# EAGLE schematic Ex 4 LED FadeInOut (EAGLE 7.6.0)
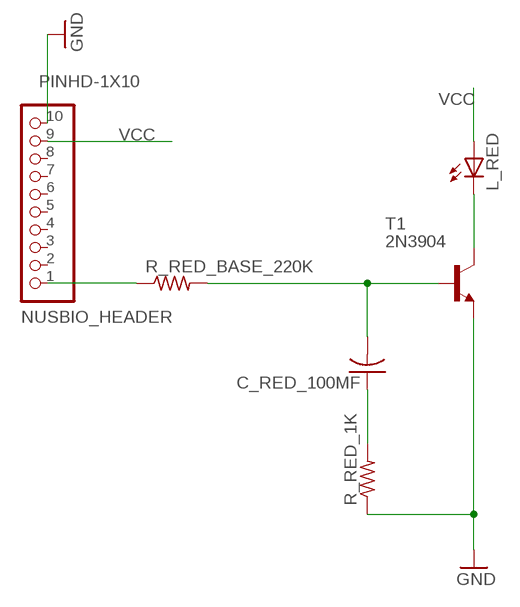
[diagram p0: schematic, sheet 1]

## Parts
C_RED_100MF  C-US025-030X050  [C025-030X050]
L_RED  LED5MM  [LED5MM]
NUSBIO_HEADER  PINHD-1X10  [1X10-BIG]
R_RED_1K  R-US_0207/10  [0207/10]
R_RED_BASE_220K  R-US_0207/10  [0207/10]
T1  2N3904  [TO92]

## Nets
GND: NUSBIO_HEADER.10 R_RED_1K.1 T1.3(E)
N$1: NUSBIO_HEADER.1 R_RED_BASE_220K.1
N$2: C_RED_100MF.2 R_RED_BASE_220K.2 T1.2(B)
N$3: L_RED.K(C) T1.1(C)
N$4: C_RED_100MF.1 R_RED_1K.2
VCC: L_RED.A NUSBIO_HEADER.9
Unconnected: NUSBIO_HEADER.2 NUSBIO_HEADER.3 NUSBIO_HEADER.4 NUSBIO_HEADER.5 NUSBIO_HEADER.6 NUSBIO_HEADER.7 NUSBIO_HEADER.8

## Library data of the parts
C_RED_100MF = adafruit:C-US: CAPACITOR, American symbol
L_RED = adafruit:LED: LED OSRAM: - CHIPLED LG R971, LG N971, LY N971, LG Q971, LY Q971, LO R971, LY R971 LH N974, LH R974 LS Q976, LO Q976, LY Q976 LO Q996 - Hyper CHIPLED LW Q18S LB Q993, LB Q99A, LB R99A - SideLED LS A670, LO A670, LY A670, LG A670, LP A670 LB A673, LV A673, LT A673, LW A673 LH A674 LY A675 LS A676, LA A676, LO A676, LY A676, LW A676 LS A679, LY A679, LG A679 - Hyper Micro SIDELED® LS Y876, LA Y876, LO Y876, LY Y876 LT Y87S - SmartLED LW L88C, LW L88S LB L89C, LB L89S, LG L890 LS L89K, LO L89K, LY L89K LS L896, LA L896, LO L896, LY L896 - TOPLED LS T670, LO T670, LY T670, LG T670, LP T670 LSG T670, LSP T670, LSY T670, LOP T670, LYG T670 LG T671, LOG T671, LSG T671 LB T673, LV T673, LT T673, LW T673 LH T674 LS T676, LA T676, LO T676, LY T676, LB T676, LH T676, LSB T676, LW T676 LB T67C, LV T67C, LT T67C, LS T67K, LO T67K, LY T67K, LW E67C LS E67B, LA E67B, LO E67B, LY E67B, LB E67C, LV E67C, LT E67C LW T67C LS T679, LY T679, LG T679 LS T770, LO T770, LY T770, LG T770, LP T770 LB T773, LV T773, LT T773, LW T773 LH T774 LS E675, LA E675, LY E675, LS T675 LS T776, LA T776, LO T776, LY T776, LB T776 LHGB T686 LT T68C, LB T68C - Hyper Mini TOPLED® LB M676 - Mini TOPLED Santana® LG M470 LS M47K, LO M47K, LY M47K Source: http://www.osram.convergy.de/
NUSBIO_HEADER = adafruit:PINHD-1X10: Pin header 1x10 0.1" spacing With round pins
R_RED_1K R_RED_BASE_220K = adafruit:R-US_: RESISTOR, American symbol
T1 = transistor:2N3904: NPN TRANSISTOR